# Altium schematic sheet design_18.SchDoc
size 414 x 279 mm; Origin: Eagle
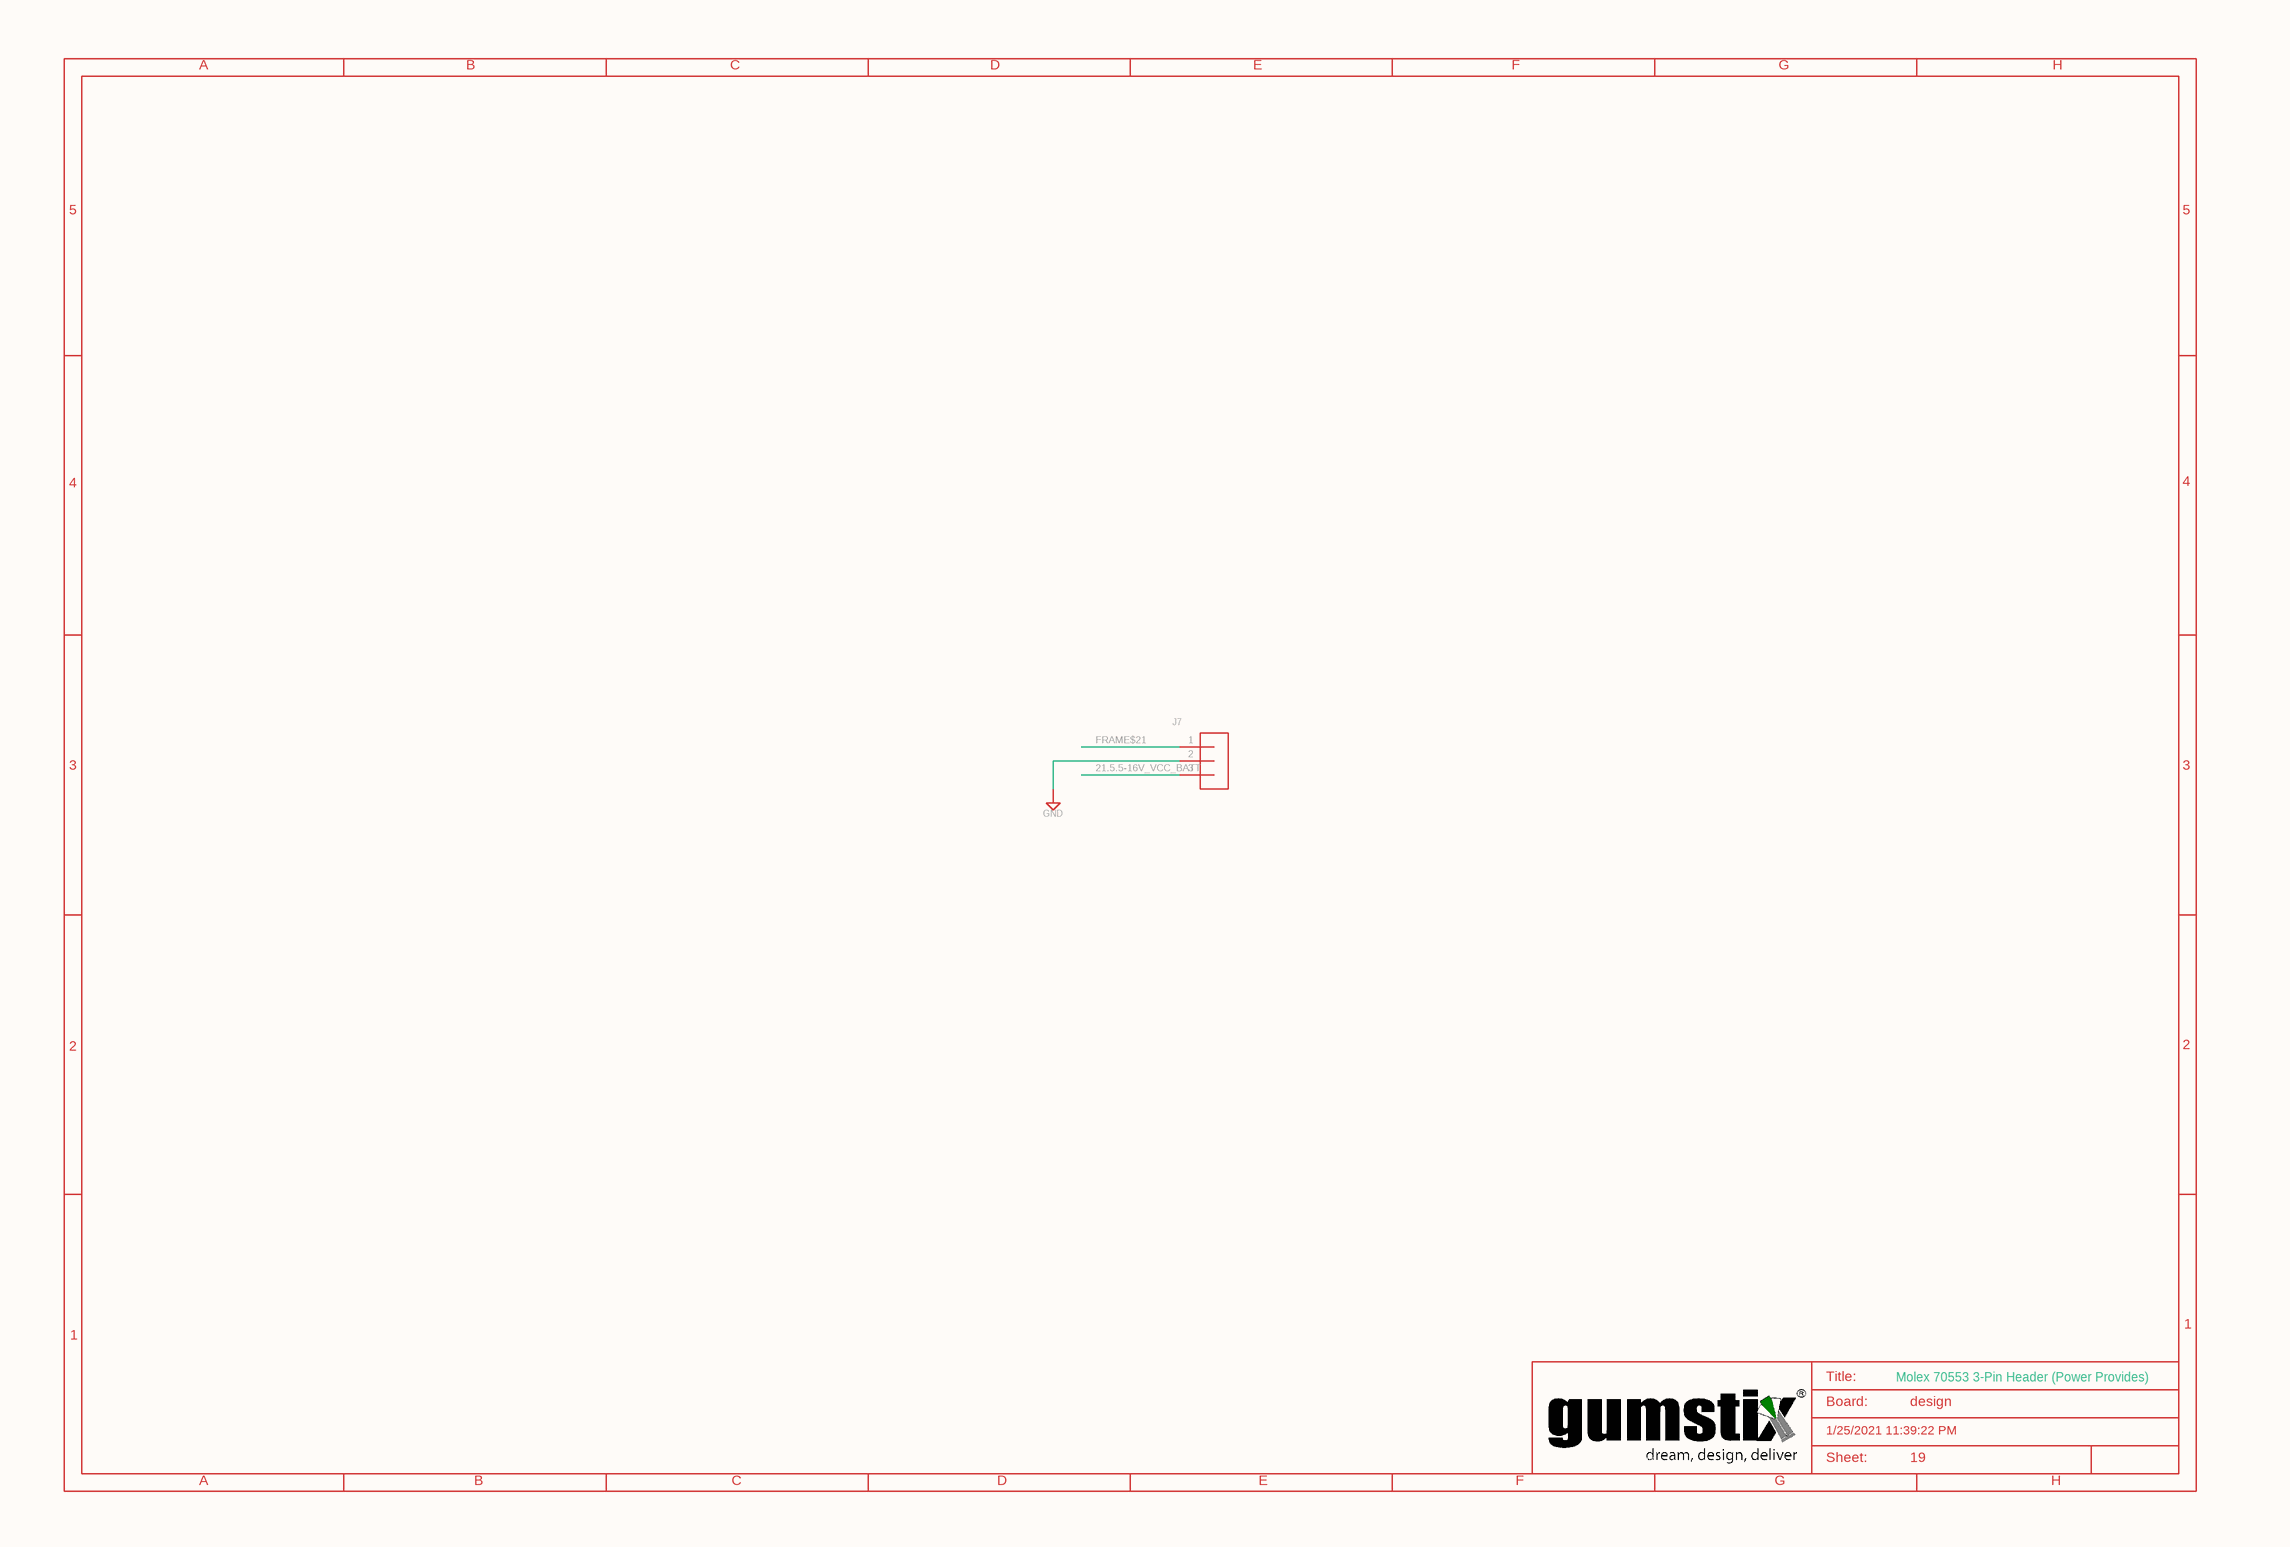
[diagram p0: design_18.SchDoc]

## Parts
J7  70553-0002  [1X03_90_TH_SHROUD]  (value not drawn)
SUPPLY192  GND
U$32  DRAWING_NAME: design  LAST_DATE_TIME: 1/25/2021 11:39:22 PM  SHEET: 19  Sheet: Sheet:  Title: Title:  Board: Board:  (hidden comment: A3-L-GUMSTIX)

## Nets
21.5.5-16V_VCC_BATT: J7.3
FRAME$21: J7.1
NetJ7_2: J7.2 SUPPLY192.?1(GND)

## Notes on the sheet
- Molex 70553 3-Pin Header (Power Provides)

## Library data of the parts
J7 = 70553-0002: Detailed Description	Connector Header Through Hole, Right Angle 3 position 0.100" (2.54mm) [SL 70533 Series]; GateName_1: G$1; SymbolName_1: 1X03; LibraryName: qualified_1; DeviceSetName: 70553-0002
SUPPLY192 = GND: SUPPLY SYMBOL; GateName_1: GND; SymbolName_1: GND; LibraryName: supply2; DeviceSetName: GND
U$32 = A3-L-GUMSTIX: GateName_1: G$1; SymbolName_1: A3-L-GUMSTIX; LibraryName: qualified_1; DeviceSetName: A3-L-GUMSTIX; A: A; B: B; C: C; D: D; E: E; F: F; G: G; H: H; 1: 1; 2: 2; 3: 3; 4: 4; 5: 5; C:/Gumstix/gumstix-logo-16.bmp: C:/Gumstix/gumstix-logo-16.bmp